# EAGLE board Hodiny4.5 ESP32 (EAGLE 9.1.3)
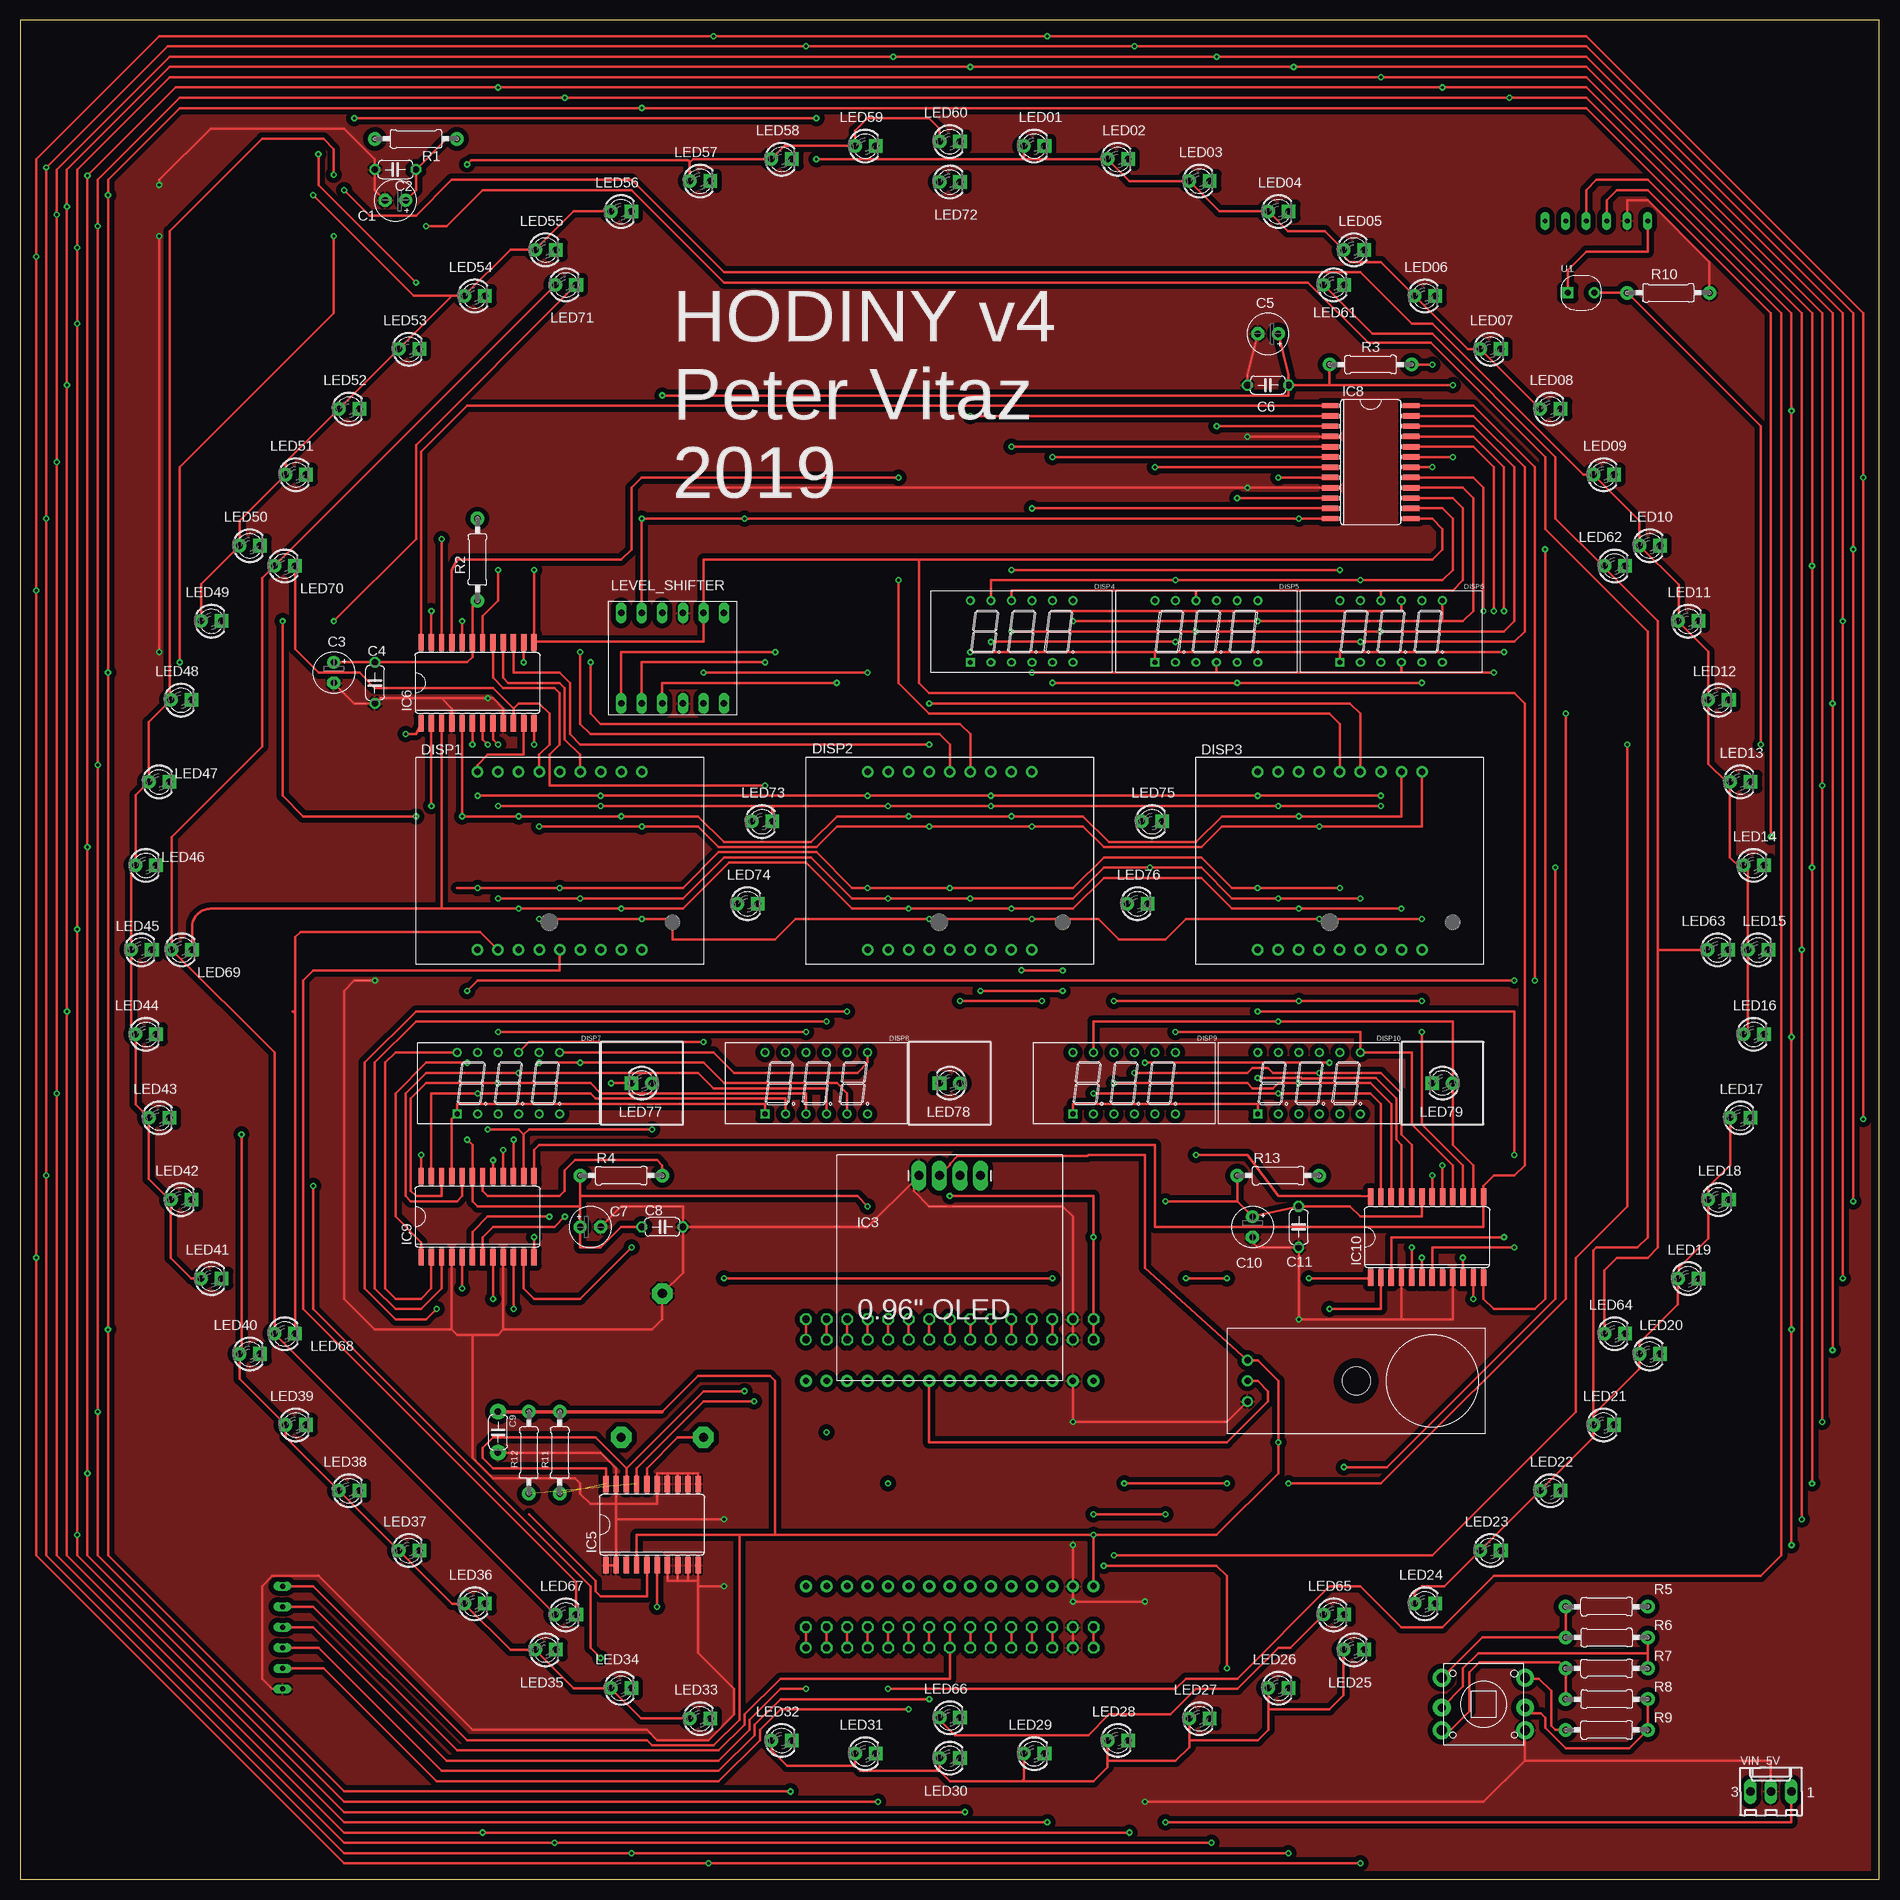
[diagram p1: board, top side]
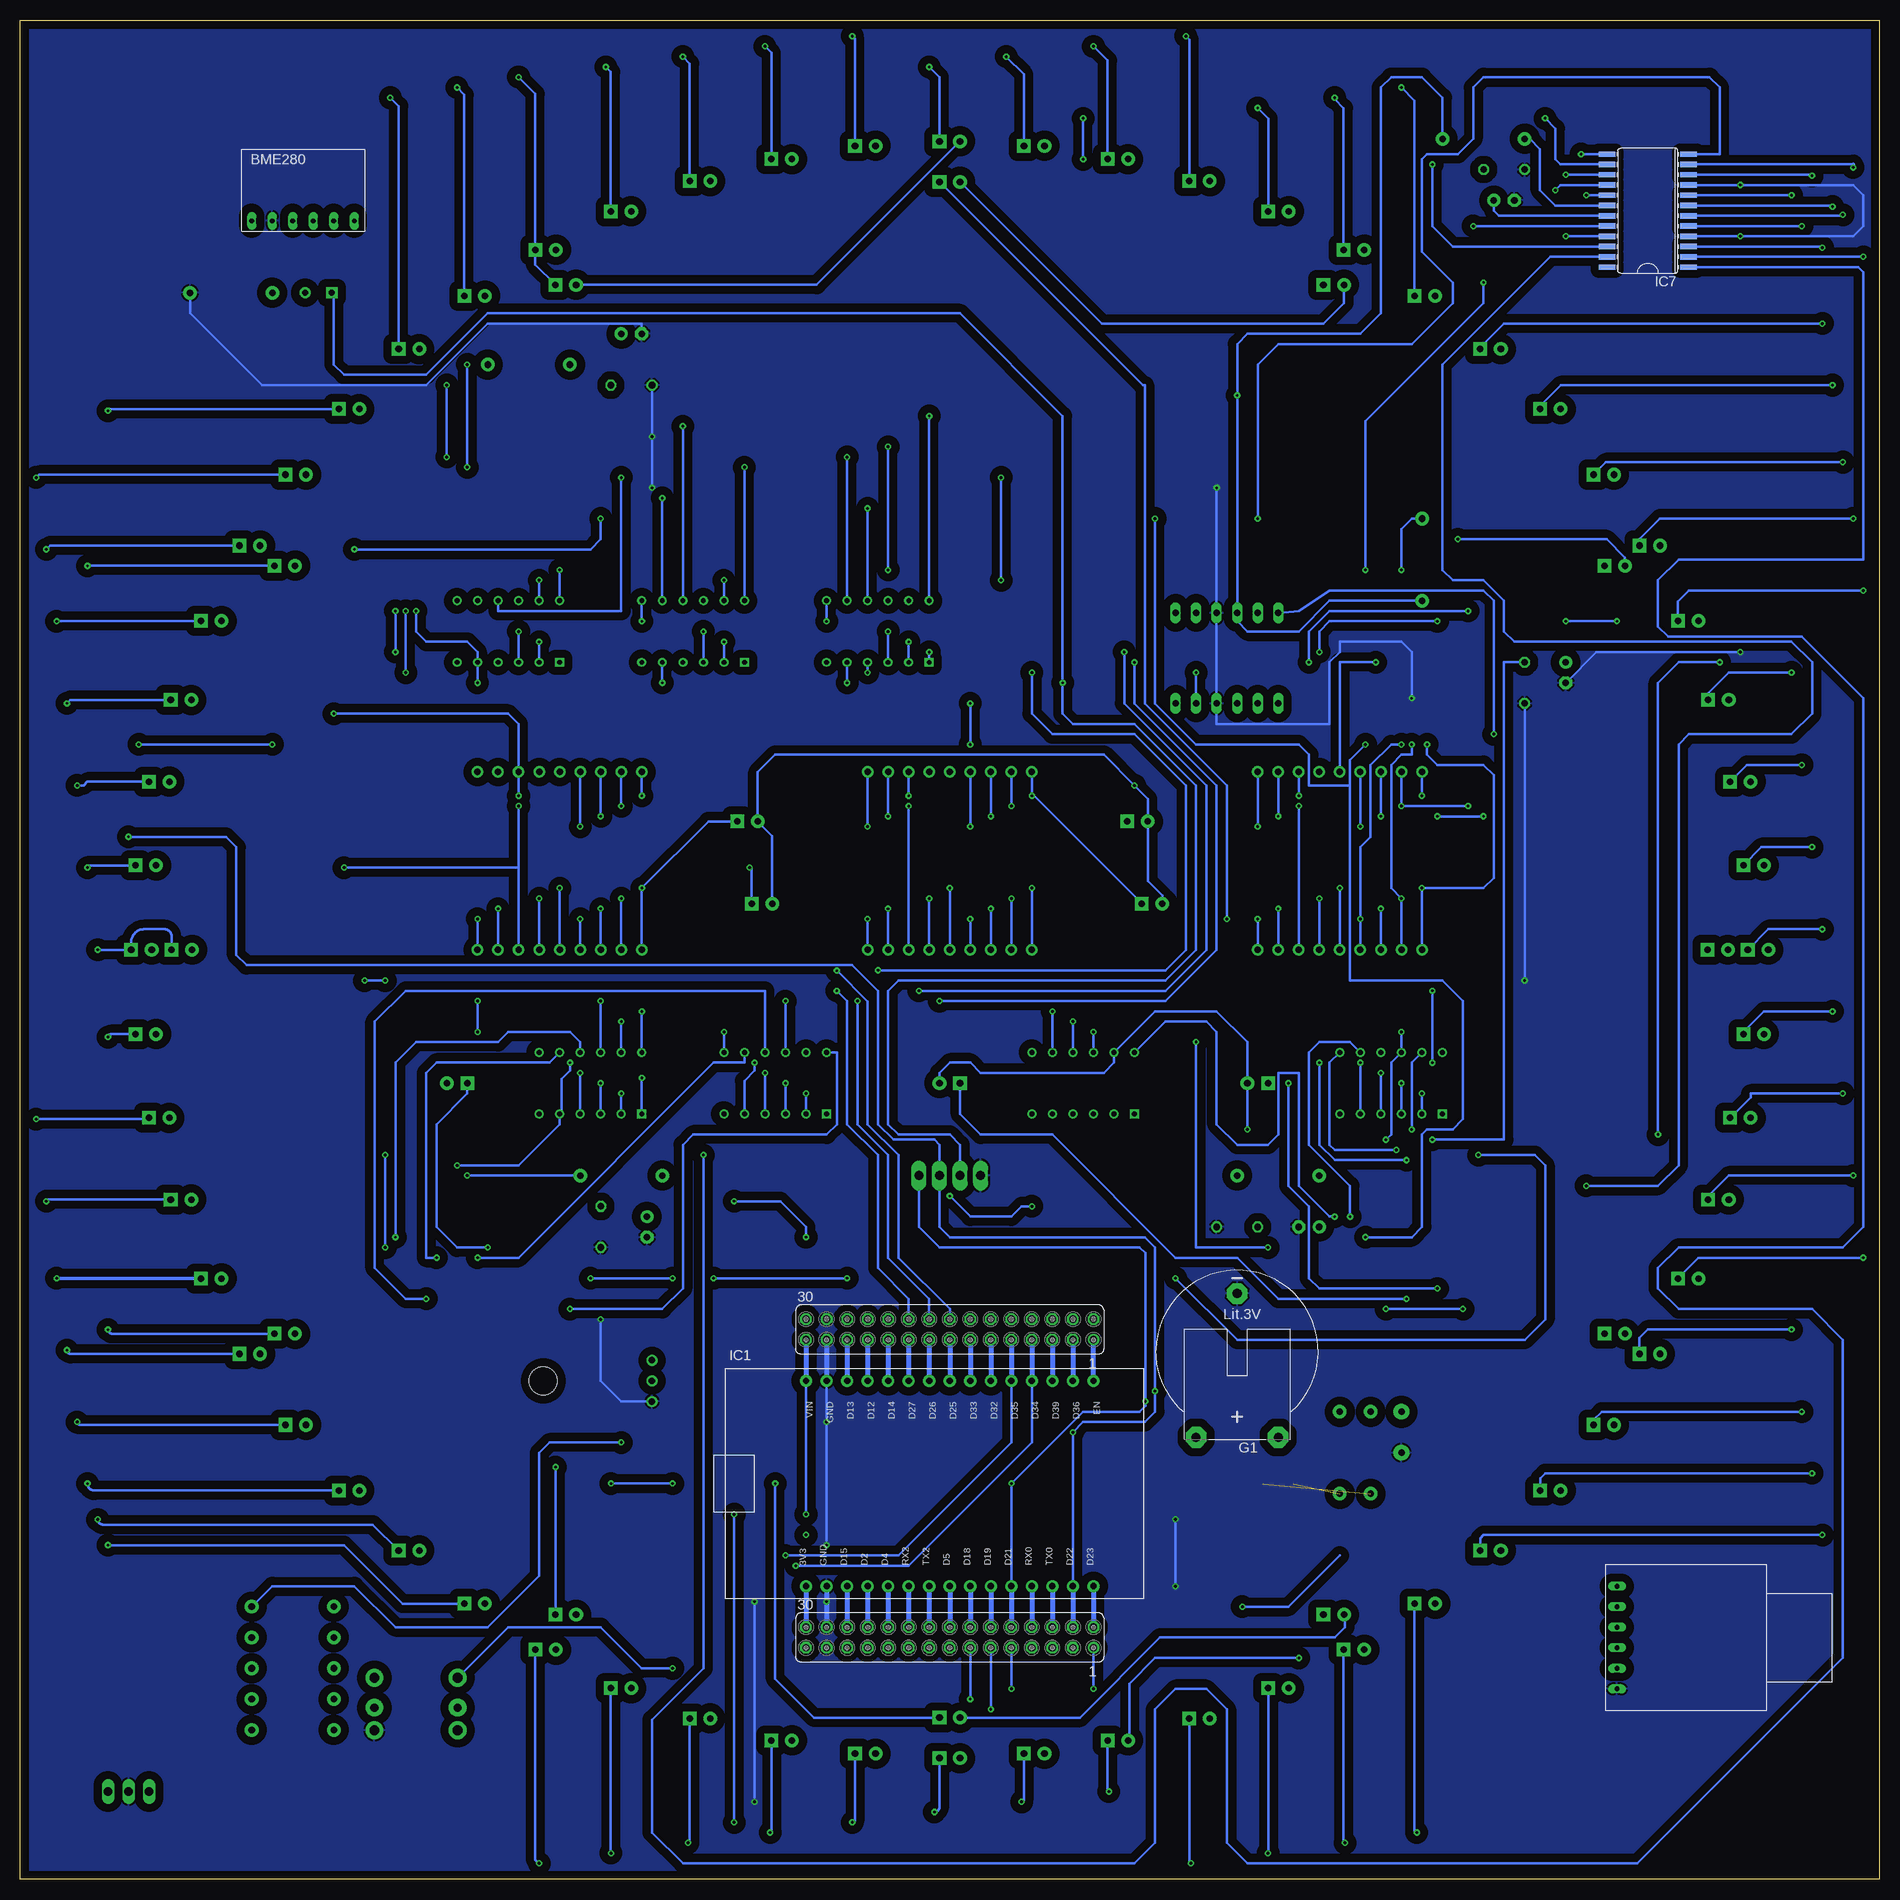
[diagram p2: board, bottom side, seen from below]

Size 230 x 230 mm. Coordinates in mm from the lower left corner, seen from the top.
Outline: 0,0 230,0 230,230 0,230 0,0
Copper layers (1*16): Top 0.035mm / dielectric 1.5mm / Bottom 0.035mm
Design rules "default": minimum track width 6mil, minimum drill 0.35mm, track to track 6mil, track to pad 6mil, pad to pad 6mil, via to via 6mil, smd to smd 6mil, copper to edge 40mil, drill to drill 6mil, minimum pad ring 10mil, minimum via ring 8mil, stop-mask expansion 4mil, vias tented up to drill 0mil, thermal gap 10mil

## Footprints (pad centres in the part's own frame; a part is rotated, then mirrored left to right if it is on the bottom)
E2,5-5 = drill 0.813 pad 1.6: + -1.27,0 | drill 0.813 pad 1.6 octagon: - 1.27,0
C050-024X044 = drill 0.813 octagon: 1 -2.54,0; 2 2.54,0
C050-024X044' = drill 0.813 pad 1.93: 1 -2.54,0; 2 2.54,0
DA08-11EWA = drill 0.8 pad 1.422: 1 -10.16,0; 2 -7.62,0; 3 -5.08,0; 4 -2.54,0; 5 0,0; 6 2.54,0; 7 5.08,0; 8 7.62,0; 9 10.16,0; 10 10.16,22; 11 7.62,22; 12 5.08,22; 13 2.54,22; 14 0,22; 15 -2.54,22; 16 -5.08,22; 17 -7.62,22; 18 -10.16,22
2381AS = drill 0.6 square: 1 0,0 | drill 0.6: 2 2.54,0; 3 5.08,0; 4 7.62,0; 5 10.16,0; 6 12.7,0; 7 12.7,7.62; 8 10.16,7.62; 9 7.62,7.62; 10 5.08,7.62; 11 2.54,7.62; 12 0,7.62
CR2032H = drill 1.118 pad 2.54 octagon: + 5.08,10.795; +@1 -5.08,10.795; - 0,-6.985
ESP32-DEVKITV1A = drill 0.8 pad 1.5: 3V3 0,0; D2 7.62,0; D4 10.16,0; D5 17.78,0; D12 7.62,25.4; D13 5.08,25.4; D14 10.16,25.4; D15 5.08,0; D18 20.32,0; D19 22.86,0; D21 25.4,0; D22 33.02,0; D23 35.56,0; D25 17.78,25.4; D26 15.24,25.4; D27 12.7,25.4; D32 22.86,25.4; D33 20.32,25.4; D34 27.94,25.4; D35 25.4,25.4; D36 33.02,25.4; D39 30.48,25.4; EN 35.56,25.4; GND 2.54,0; GND2 2.54,25.4; RX0 27.94,0; RX2 12.7,0; TX0 30.48,0; TX2 15.24,0; VIN 0,25.4
BME280_MODULE = drill 0.6 long: CSB 10.16,0; GND 2.54,0; SCL 5.08,0; SDA 7.62,0; SDO 12.7,0; VCC 0,0
I2C_OLED_PACKAGE = drill 1.118 pad 1.88 long: 1 0,0; 2 2.54,0; 3 5.08,0; 4 7.62,0
SD_CARD = drill 0.6 long: 3V3 12.7,0; CLK 5.08,0; CS 10.16,0; GND 0,0; MISO 2.54,0; MOSI 7.62,0
SO20L = smd 0.66 x 2.032: 1 -5.715,-5.029; 2 -4.445,-5.029; 3 -3.175,-5.029; 4 -1.905,-5.029; 5 -0.635,-5.029; 6 0.635,-5.029; 7 1.905,-5.029; 8 3.175,-5.029; 9 4.445,-5.029; 10 5.715,-5.029; 11 5.715,5.029; 12 4.445,5.029; 13 3.175,5.029; 14 1.905,5.029; 15 0.635,5.029; 16 -0.635,5.029; 17 -1.905,5.029; 18 -3.175,5.029; 19 -4.445,5.029; 20 -5.715,5.029
SO24L = smd 0.66 x 2.032: 1 -6.985,-5.029; 2 -5.715,-5.029; 3 -4.445,-5.029; 4 -3.175,-5.029; 5 -1.905,-5.029; 6 -0.635,-5.029; 7 0.635,-5.029; 8 1.905,-5.029; 9 3.175,-5.029; 10 4.445,-5.029; 11 5.715,-5.029; 12 6.985,-5.029; 13 6.985,5.029; 14 5.715,5.029; 15 4.445,5.029; 16 3.175,5.029; 17 1.905,5.029; 18 0.635,5.029; 19 -0.635,5.029; 20 -1.905,5.029; 21 -3.175,5.029; 22 -4.445,5.029; 23 -5.715,5.029; 24 -6.985,5.029
LED3MM = drill 0.813 pad 1.676: A -1.27,0 | drill 0.813 pad 1.676 square: K 1.27,0
LVS_4 = drill 0.8 long: 1 0,0; 2 2.54,0; 3 5.08,0; 4 7.62,0; 5 10.16,0; 6 12.7,0; 7 12.7,11.2; 8 10.16,11.2; 9 7.62,11.2; 10 5.08,11.2; 11 2.54,11.2; 12 0,11.2
0207/10 = drill 0.813 pad 1.676: 1 -5.08,0; 2 5.08,0
FE15-2 = drill 0.914: 1 -17.78,1.27 | drill 0.914 octagon: 2 -17.78,-1.27; 3 -15.24,1.27; 4 -15.24,-1.27; 5 -12.7,1.27; 6 -12.7,-1.27; 7 -10.16,1.27; 8 -10.16,-1.27; 9 -7.62,1.27; 10 -7.62,-1.27; 11 -5.08,1.27; 12 -5.08,-1.27; 13 -2.54,1.27; 14 -2.54,-1.27; 15 0,1.27; 16 0,-1.27; 17 2.54,1.27; 18 2.54,-1.27; 19 5.08,1.27; 20 5.08,-1.27; 21 7.62,1.27; 22 7.62,-1.27; 23 10.16,1.27; 24 10.16,-1.27; 25 12.7,1.27; 26 12.7,-1.27; 27 15.24,1.27; 28 15.24,-1.27; 29 17.78,1.27; 30 17.78,-1.27
5-WAY-SWITCH = drill 1.2 pad 2.184: 1 -5.157,3.275; 3 -5.157,-3.225; 4 5.143,-3.225; 6 5.143,3.275 | drill 1 pad 2.184: 2 -5.157,-0.425; 5 5.143,-0.425
SNR2-3.0 = drill 0.762 pad 1.397 square: 1 -1.651,0 | drill 0.762 pad 1.397: 2 1.651,0
BUZZER = drill 0.8: GND 0,-2.54; IO 0,0; VCC 0,2.54 | hole 3.5: 13.46,0
6410-03 = drill 1.016 long: 1 2.54,0; 2 0,0; 3 -2.54,0

## Placement (x,y rotation side)
C1  10u  [E2,5-5]  46.42,207.71 180 top
C2  100n  [C050-024X044]  46.42,211.52 180 top
C3  10u  [E2,5-5]  38.8,149.29 270 top
C4  100n  [C050-024X044]  43.88,148.02 270 top
C5  10u  [E2,5-5]  154.37,191.2 180 top
C6  100n  [C050-024X044]  154.37,184.85 180 top
C7  10u  [E2,5-5]  70.55,80.71 0 top
C8  100n  [C050-024X044]  79.44,80.71 0 top
C9  100n  [C050-024X044']  59.12,55.31 270 top
C10  10u  [E2,5-5]  152.47,80.71 270 top
C11  100n  [C050-024X044]  158.18,80.71 270 top
DISP1  [DA08-11EWA]  66.74,115 0 top
DISP2  [DA08-11EWA]  115,115 0 top
DISP3  [DA08-11EWA]  163.26,115 0 top
DISP4  2381AS  [2381AS]  117.54,150.56 0 top
DISP5  2381AS  [2381AS]  140.4,150.56 0 top
DISP6  2381AS  [2381AS]  163.26,150.56 0 top
DISP7  2381AS  [2381AS]  54.04,94.68 0 top
DISP8  2381AS  [2381AS]  92.14,94.68 0 top
DISP9  2381AS  [2381AS]  130.24,94.68 0 top
DISP10  2381AS  [2381AS]  153.1,94.68 0 top
G1  CR2032H  [CR2032H]  79.44,65.47 180 bottom
IC1  ESP32DEVKITV1NEW  [ESP32-DEVKITV1A]  132.78,36.26 0 bottom
IC2  BME280_MODULE  [BME280_MODULE]  201.36,205.17 0 bottom
IC3  I2C_OLED_NEW  [I2C_OLED_PACKAGE]  111.19,87.06 0 top
IC4  SD_CARD_MODULE  [SD_CARD]  32.45,23.56 90 bottom
IC5  DS3232  [SO20L]  78.17,43.88 0 top
IC6  MAX7219CWG  [SO24L]  56.58,148.02 0 top
IC7  MAX7219CWG  [SO24L]  28.64,206.44 90 bottom
IC8  MAX7219CWG  [SO24L]  167.07,175.32 270 top
IC9  MAX7219CWG  [SO24L]  56.58,81.98 0 top
IC10  MAX7219CWG  [SO24L]  174.06,79.44 0 top
LED01  [LED3MM]  125.45,214.45 0 top
LED02  [LED3MM]  135.79,212.81 0 top
LED03  [LED3MM]  145.9,210.11 0 top
LED04  [LED3MM]  155.67,206.35 0 top
LED05  [LED3MM]  165,201.6 0 top
LED06  [LED3MM]  173.78,195.9 0 top
LED07  [LED3MM]  181.91,189.31 0 top
LED08  [LED3MM]  189.31,181.91 0 top
LED09  [LED3MM]  195.9,173.78 0 top
LED10  [LED3MM]  201.6,165 0 top
LED11  [LED3MM]  206.35,155.67 0 top
LED12  [LED3MM]  210.11,145.9 0 top
LED13  [LED3MM]  212.81,135.79 0 top
LED14  [LED3MM]  214.45,125.45 0 top
LED15  [LED3MM]  215,115 0 top
LED16  [LED3MM]  214.45,104.55 0 top
LED17  [LED3MM]  212.81,94.21 0 top
LED18  [LED3MM]  210.11,84.1 0 top
LED19  [LED3MM]  206.35,74.33 0 top
LED20  [LED3MM]  201.6,65 0 top
LED21  [LED3MM]  195.9,56.22 0 top
LED22  [LED3MM]  189.31,48.09 0 top
LED23  [LED3MM]  181.91,40.69 0 top
LED24  [LED3MM]  173.78,34.1 0 top
LED25  [LED3MM]  165,28.4 0 top
LED26  [LED3MM]  155.67,23.65 0 top
LED27  [LED3MM]  145.9,19.89 0 top
LED28  [LED3MM]  135.79,17.19 0 top
LED29  [LED3MM]  125.45,15.55 0 top
LED30  [LED3MM]  115,15 0 top
LED31  [LED3MM]  104.55,15.55 0 top
LED32  [LED3MM]  94.21,17.19 0 top
LED33  [LED3MM]  84.1,19.89 0 top
LED34  [LED3MM]  74.33,23.65 0 top
LED35  [LED3MM]  65,28.4 0 top
LED36  [LED3MM]  56.22,34.1 0 top
LED37  [LED3MM]  48.09,40.69 0 top
LED38  [LED3MM]  40.69,48.09 0 top
LED39  [LED3MM]  34.1,56.22 0 top
LED40  [LED3MM]  28.4,65 0 top
LED41  [LED3MM]  23.65,74.33 0 top
LED42  [LED3MM]  19.89,84.1 0 top
LED43  [LED3MM]  17.19,94.21 0 top
LED44  [LED3MM]  15.55,104.55 0 top
LED45  [LED3MM]  15,115 0 top
LED46  [LED3MM]  15.55,125.45 0 top
LED47  [LED3MM]  17.19,135.79 0 top
LED48  [LED3MM]  19.89,145.9 0 top
LED49  [LED3MM]  23.65,155.67 0 top
LED50  [LED3MM]  28.4,165 0 top
LED51  [LED3MM]  34.1,173.78 0 top
LED52  [LED3MM]  40.69,181.91 0 top
LED53  [LED3MM]  48.09,189.31 0 top
LED54  [LED3MM]  56.22,195.9 0 top
LED55  [LED3MM]  65,201.6 0 top
LED56  [LED3MM]  74.33,206.35 0 top
LED57  [LED3MM]  84.1,210.11 0 top
LED58  [LED3MM]  94.21,212.81 0 top
LED59  [LED3MM]  104.55,214.45 0 top
LED60  [LED3MM]  115,215 0 top
LED61  [LED3MM]  162.5,197.27 0 top
LED62  [LED3MM]  197.27,162.5 0 top
LED63  [LED3MM]  210,115 0 top
LED64  [LED3MM]  197.27,67.5 0 top
LED65  [LED3MM]  162.5,32.73 0 top
LED66  [LED3MM]  115,20 0 top
LED67  [LED3MM]  67.5,32.73 0 top
LED68  [LED3MM]  32.73,67.5 0 top
LED69  [LED3MM]  20,115 0 top
LED70  [LED3MM]  32.73,162.5 0 top
LED71  [LED3MM]  67.5,197.27 0 top
LED72  [LED3MM]  115,210 0 top
LED73  [LED3MM]  91.77,130.88 0 top
LED74  [LED3MM]  89.97,120.72 0 top
LED75  [LED3MM]  140.03,130.88 0 top
LED76  [LED3MM]  138.24,120.72 0 top
LED77  [LED3MM]  76.9,98.49 180 top
LED78  [LED3MM]  115,98.49 180 top
LED79  [LED3MM]  175.96,98.49 180 top
LEVEL_SHIFTER  LEVEL_SHIFTER_4  [LVS_4]  74.36,145.48 0 top
R1  27k  [0207/10]  48.96,215.33 180 top
R2  27k  [0207/10]  56.58,163.26 90 top
R3  27k  [0207/10]  167.07,187.39 0 top
R4  27k  [0207/10]  74.36,87.06 0 top
R5  2k  [0207/10]  196.28,33.72 0 top
R6  330  [0207/10]  196.28,29.91 180 top
R7  620  [0207/10]  196.28,26.1 0 top
R8  1k  [0207/10]  196.28,22.29 180 top
R9  3k3  [0207/10]  196.28,18.48 0 top
R10  10k  [0207/10]  203.9,196.28 180 top
R11  1k2  [0207/10]  66.74,52.77 90 top
R12  1k2  [0207/10]  62.93,52.77 90 top
R13  27k  [0207/10]  155.64,87.06 0 top
SV1  [FE15-2]  115,29.91 180 bottom
SV2  [FE15-2]  115,68.01 180 bottom
SWITCH  5-WAY-SWITCH  [5-WAY-SWITCH]  181.04,21.66 0 top
U1  VT93N2  [SNR2-3.0]  193.11,196.28 0 top
U$2  BUZZER_FC-07  [BUZZER]  151.83,61.66 0 top
VIN_5V  22-27-2031-03  [6410-03]  216.6,10.86 0 top

## Tracks (layer width: path | path; a pad name or v marks a point on that pad's centre or on a via)
3V3  (via drill 0.35)
  Top 0.305: 191.2,196.53 U1.1 191.45,199.07 193.74,201.36 201.36,201.36 IC2.VCC | LEVEL_SHIFTER.3 79.44,148.02 v101.03,148.02 | IC4.3V3 36.26,36.26 55.31,17.21 77.53,17.21 78.17,16.58 85.79,16.58 88.97,19.75 88.97,42.61 | v132.78,42.61 148.02,42.61 155.64,50.23 v155.64,54.04 155.64,61.66 153.1,64.2 U$2.VCC 139.13,75.63 139.13,89.6 132.15,89.6 132.02,89.48 115.99,89.48 115.03,88.52 115.03,88.36 IC3.2 | v132.78,42.61 IC1.3V3 | v132.78,42.61 93.41,42.61 | 93.41,42.61 88.97,42.61 | 88.97,42.61 76.27,42.61 IC5.4 | 79.44,57.85 83.89,62.3 92.78,62.3 93.41,61.66 93.41,42.61 | SV1.30 SV1.29
  Top 0.406: C9.1 R12.2 R11.2 79.44,57.85
  Bottom 0.305: U1.1 191.2,196.03 191.2,187.39 189.93,186.12 179.77,186.12 172.15,193.74 113.73,193.74 101.03,181.04 v101.03,148.02 101.03,144.21 99.76,142.94 92.14,142.94 84.52,135.32 84.52,115 88.33,111.19 121.35,111.19 122.62,109.92 122.62,93.41 121.35,92.14 115,92.14 113.73,90.87 IC3.2 | R5.2 198.82,36.26 188.66,36.26 183.58,31.18 172.15,31.18 165.8,37.53 165.8,52.77 164.53,54.04 v155.64,54.04
  Bottom 0.61: IC1.3V3 SV1.30
!INT
  Top 0.305: IC5.5 77.53,34.99 71.82,34.99 71.19,35.62 71.19,36.89 62.93,45.15
!RST  (via drill 0.35)
  Top 0.305: IC5.6 v78.81,33.72
  Bottom 0.305: v78.81,33.72 73.09,33.72 66.74,40.07
+5V  (via drill 0.35)
  Top 0.305: C6.1 156.91,186.12 C5.+ | IC8.19 v177.23,175.96 | v177.23,184.85 161.99,184.85 | 161.99,184.85 C6.1 | R3.1 161.99,184.85 | R1.1 52.77,215.33 C2.1 48.96,208.98 C1.+ | C3.+ C4.1 55.31,150.56 55.95,151.19 IC6.19 55.95,157.55 R2.1 | C6.1 156.91,183.58 v79.44,183.58 | 69.28,83.25 56.58,83.25 55.95,83.89 IC9.19 55.95,90.87 v55.31,91.5 | 69.28,83.25 69.28,84.52 | 69.28,84.52 R4.1 | 69.28,83.25 C7.+ 69.28,78.17 71.82,78.17 74.36,80.71 C8.1 | VIN_5V.1 219.14,7.05 v141.67,7.05 | v132.78,45.15 v141.67,45.15 | R13.1 150.56,83.89 | 150.56,83.89 C10.+ C11.1 164.53,83.25 165.8,81.98 173.42,81.98 IC10.19 | 150.56,83.89 v141.67,83.89 | 69.28,84.52 103.57,84.52 v104.84,83.25 | v115,84.52 132.78,84.52 v132.78,79.44 SV2.30 SV2.29
  Bottom 0.305: v177.23,175.96 v177.23,184.85 | IC7.19 47.06,205.81 47.69,206.44 C1.+ | R2.1 68.01,158.18 71.82,154.37 78.17,154.37 79.44,155.64 LEVEL_SHIFTER.10 v79.44,183.58 79.44,189.93 78.17,191.2 64.2,191.2 61.66,193.74 61.66,221.68 60.39,222.95 56.58,222.95 54.04,220.41 R1.1 | v55.31,91.5 46.42,91.5 46.42,150.56 C4.1 | IC1.VIN v132.78,45.15 | v132.78,79.44 132.78,80.71 135.95,83.89 v141.67,83.89 | v104.84,83.25 106.11,83.25 107.38,81.98 112.46,81.98 v115,84.52 | v141.67,45.15 v141.67,7.05
  Bottom 0.61: SV2.29 IC1.VIN
A0  (via drill 0.35)
  Top 0.305: U1.2 R10.2 215.33,179.77 v215.33,140.4 | SV2.10 SV2.9 | v198.82,140.4 198.82,83.25 192.47,76.9 192.47,57.85 174.69,40.07 155.64,40.07 v135.32,40.07
  Bottom 0.305: v215.33,140.4 v198.82,140.4 | IC1.D35 107.38,54.04 121.35,40.07 134.05,40.07 v135.32,40.07
  Bottom 0.61: SV2.9 IC1.D35
BUZZ
  Top 0.305: U$2.IO 153.1,61.66 154.37,60.39 154.37,59.12 149.29,54.04 112.46,54.04 IC1.D33 | SV2.13 SV2.14
  Bottom 0.61: SV2.13 IC1.D33
CLK_H  (via drill 0.35)
  Top 0.305: IC8.13 174.69,168.34 175.96,167.07 175.96,164.53 174.69,163.26 111.19,163.26 | 111.19,163.26 84.52,163.26 LEVEL_SHIFTER.8 84.52,153.1 63.62,153.1 IC6.13 v63.56,161.99 | 111.19,163.26 111.19,148.02 112.46,146.75 184.85,146.75 186.12,145.48 186.12,88.33 184.85,87.06 182.31,87.06 181.04,85.79 IC10.13 181.04,80.71 140.4,80.71 140.4,90.87 64.2,90.87 63.56,90.23 IC9.13 | v36.89,213.43 36.89,209.62 v48.96,197.55
  Bottom 0.305: IC7.13 v36.89,213.43 | v48.96,197.55 48.96,195.01 63.56,180.41 v63.56,161.99
CLK_L  (via drill 0.35)
  Top 0.305: v104.84,149.29 v84.52,149.29 | v123.89,112.46 128.97,112.46 v128.97,112.41 | SV2.16 SV2.15
  Bottom 0.305: LEVEL_SHIFTER.5 v84.52,149.29 | v104.84,149.29 104.84,144.21 102.3,141.67 92.14,141.67 85.79,135.32 85.79,115 88.33,112.46 v123.89,112.46 | v128.97,112.41 125.16,108.6 125.16,93.41 121.35,89.6 121.35,76.9 115,70.55 SV2.16
  Bottom 0.61: SV2.15 IC1.D25
DG0  (via drill 0.35)
  Top 0.305: v59.12,132.78 v71.82,132.78 93.41,132.78 | 93.41,132.78 v107.38,132.78 v120.08,132.78 v155.64,132.78 v168.34,132.78 | LED73.K 93.03,132.41 arc-90 93.41,132.78 | IC6.2 v50.86,132.78 | v189.93,125.16 189.93,71.82 169.1,50.99 v163.77,50.99
  Bottom 0.305: DISP1.17 v59.12,132.78 v50.86,132.78 | v107.38,132.78 DISP2.17 | v155.64,132.78 DISP3.17 | DISP1.7 v71.82,132.78 | DISP2.7 v120.08,132.78 | DISP3.7 168.34,125.16 | 168.34,125.16 v168.34,132.78 | LED65.K v163.77,50.99 | 168.34,125.16 v189.93,125.16
DG1  (via drill 0.35)
  Top 0.305: v56.58,134.05 v71.82,134.05 v104.84,134.05 v120.08,134.05 v153.1,134.05 v168.34,134.05 | DISP1.18 56.58,137.86 57.85,139.13 62.3,139.13 62.3,141.67 62.3,142.31 IC6.11 | v191.2,144.21 191.2,71.82 168.34,48.96 v156.91,48.96 | v149.29,48.96 v136.59,48.96
  Bottom 0.305: DISP1.18 v56.58,134.05 | DISP2.18 v104.84,134.05 104.58,134.05 LED74.K | v168.34,134.05 DISP3.12 168.34,142.94 169.61,144.21 v191.2,144.21 | DISP3.18 v153.1,134.05 | DISP2.12 v120.08,134.05 | DISP1.12 v71.82,134.05 | LED66.K 131.76,20 136.59,24.83 v136.59,48.96 | v156.91,48.96 v149.29,48.96
DG2  (via drill 0.35)
  Top 0.305: v163.26,122.62 v153.1,122.62 149.93,122.62 146.12,126.43 134.05,126.43 130.24,122.62 v115,122.62 v104.84,122.62 102.94,122.62 98.49,127.06 86.42,127.06 81.98,122.62 v66.74,122.62 v56.58,122.62 54.04,122.62 | IC6.6 v55.95,140.4 | DISP1.5 66.74,112.46 36.26,112.46 34.99,111.19 34.99,70.55 68.77,36.77 LED67.K
  Bottom 0.305: DISP1.1 v56.58,122.62 48.96,122.62 47.69,123.89 47.69,136.59 48.96,137.86 54.67,137.86 55.95,139.13 v55.95,140.4 | v66.74,122.62 DISP1.5 | DISP2.1 v104.84,122.62 | DISP2.5 v115,122.62 | DISP3.1 v153.1,122.62 144.84,130.88 LED75.K | DISP3.5 v163.26,122.62
DG3  (via drill 0.35)
  Top 0.305: v59.12,121.35 v69.28,121.35 81.98,121.35 87.06,126.43 97.86,126.43 102.94,121.35 v107.38,121.35 v117.54,121.35 130.24,121.35 134.05,125.16 v139.76,125.16 146.12,125.16 149.93,121.35 v155.64,121.35 v165.8,121.35 | LED68.K 34,107.1 | 34,107.1 arc90 33.72,107.38 | IC6.7 57.22,141.03 v57.85,140.4 | DISP1.2 56.9,117.22 34.67,117.22 34,116.55 34,107.1
  Bottom 0.305: DISP1.2 v59.12,121.35 60.39,122.62 60.39,137.86 59.12,139.13 57.85,139.13 v57.85,140.4 | v69.28,121.35 DISP1.6 | DISP2.2 v107.38,121.35 | DISP2.6 v117.54,121.35 | DISP3.2 v155.64,121.35 | DISP3.6 v165.8,121.35 | LED76.K 139.5,124.9 v139.76,125.16
DG4  (via drill 0.35)
  Top 0.305: v170.88,120.08 v158.18,120.08 149.93,120.08 146.12,123.89 134.05,123.89 130.24,120.08 v122.62,120.08 v109.92,120.08 102.94,120.08 97.22,125.8 87.69,125.8 81.98,120.08 v74.36,120.08 v61.66,120.08 52.13,120.08 | 21.02,114.75 arc-90 LED69.K 21.27,117.79 arc-90 23.56,120.08 52.13,120.08 | IC6.3 52.13,120.08
  Bottom 0.305: DISP1.3 v61.66,120.08 | DISP1.8 v74.36,120.08 | v122.62,120.08 DISP2.8 | DISP2.3 v109.92,120.08 | DISP3.3 v158.18,120.08 | DISP3.8 v170.88,120.08
DG5  (via drill 0.35)
  Top 0.305: v64.2,130.24 v76.9,130.24 83.89,130.24 86.42,127.7 98.49,127.7 101.03,130.24 v112.46,130.24 v125.16,130.24 131.51,130.24 134.05,127.7 146.12,127.7 148.66,130.24 v160.72,130.24 173.42,130.24 DISP3.10 | IC6.10 61.02,144.84 | DISP1.15 64.2,139.13 65.47,140.4 65.47,144.21 64.2,145.48 61.66,145.48 61.02,144.84 | 61.02,144.84 58.48,147.38 43.88,147.38 41.97,149.29 36.89,149.29 34,152.19 LED70.K
  Bottom 0.305: DISP1.15 v64.2,130.24 | v112.46,130.24 DISP2.15 | DISP1.10 v76.9,130.24 | DISP2.10 v125.16,130.24 | DISP3.15 v160.72,130.24
DG6  (via drill 0.35)
  Top 0.305: IC6.5 v54.67,131.51 v61.66,131.51 v74.36,131.51 83.89,131.51 87.06,128.34 97.86,128.34 101.03,131.51 v109.92,131.51 v122.62,131.51 131.51,131.51 134.69,128.34 145.48,128.34 148.66,131.51 v158.18,131.51 170.88,131.51 DISP3.11 | v32.45,155.64 32.45,134.05 34.99,131.51 v48.96,131.51 | v38.8,155.64 48.96,165.8 48.96,177.46 LED71.K
  Bottom 0.305: DISP1.16 v61.66,131.51 | v109.92,131.51 DISP2.16 | DISP1.11 v74.36,131.51 | DISP2.11 v122.62,131.51 | DISP3.16 v158.18,131.51 | v54.67,131.51 v48.96,131.51 | v32.45,155.64 v38.8,155.64
DG7  (via drill 0.35)
  Top 0.305: v64.2,118.81 v76.9,118.81 v80.71,118.81 80.71,116.27 93.41,116.27 95.95,118.81 v112.46,118.81 v125.16,118.81 133.41,118.81 135.95,116.27 141.67,116.27 144.21,118.81 v160.72,118.81 v173.42,118.81 | v59.12,140.4 58.48,141.03 IC6.8
  Bottom 0.305: DISP1.4 v64.2,118.81 64.2,127.7 62.93,128.97 62.93,137.86 60.39,140.4 v59.12,140.4 | DISP1.9 v76.9,118.81 | DISP2.9 v125.16,118.81 | DISP3.4 v160.72,118.81 | v173.42,118.81 DISP3.9 | DISP2.4 v112.46,118.81 | v80.71,118.81 80.71,135.32 90.87,145.48 90.87,184.85 91.12,184.85 LED72.K
DIG0  (via drill 0.35)
  Top 0.305: v228.03,94.05 v228.03,173.42 228.03,193.74 193.74,228.03 v127.06,228.03 v85.79,228.03 17.21,228.03 1.97,212.79 v1.97,200.72 v1.97,159.45 v1.97,76.9 1.97,40.07 40.07,1.97 v85.16,1.97 v165.8,1.97
  Bottom 0.305: LED41.K 24.92,74.36 22.38,76.9 v1.97,76.9 | v228.03,94.05 214.25,94.05 arc-90 LED17.K | LED57.K 85.37,227.61 v85.79,228.03 | LED49.K 24.92,158.09 23.56,159.45 v1.97,159.45 | IC7.2 v1.97,200.72 | LED09.K 227.67,173.78 v228.03,173.42 | LED25.K 166.27,2.44 v165.8,1.97 | LED33.K 85.37,2.19 v85.16,1.97 | v127.06,228.03 126.72,227.69 LED01.K
DIG1  (via drill 0.35)
  Top 0.305: v156.91,3.24 v75.63,3.24 40.07,3.24 3.24,40.07 v3.24,87.06 v3.24,168.34 v3.24,211.77 18.23,226.76 v97.22,226.76 v137.86,226.76 193.74,226.76 226.76,193.74 v226.76,164.53 v226.76,83.89
  Bottom 0.305: LED02.K 137.06,225.96 v137.86,226.76 | LED58.K 95.48,225.02 v97.22,226.76 | LED50.K 29.67,165.8 27.13,168.34 v3.24,168.34 | LED42.K 21.16,84.52 18.62,87.06 v3.24,87.06 | LED34.K 75.6,3.27 arc90 v75.63,3.24 | LED26.K 156.94,3.27 arc-90 v156.91,3.24 | LED10.K 226.29,165 v226.76,164.53 | LED18.K 226.55,84.1 arc-90 v226.76,83.89 | IC7.11 3.24,212.16
  Bottom 0.406: 3.24,212.16 v3.24,211.77
DIG2  (via drill 0.35)
  Top 0.305: v147.38,4.51 v66.1,4.51 40.07,4.51 4.51,40.07 v4.51,97.22 v4.51,175.32 v4.51,205.93 4.51,211.52 18.48,225.49 v108.02,225.49 v148.02,225.49 193.74,225.49 225.49,193.74 v225.49,155.64 v225.49,74.36
  Bottom 0.305: LED59.K 105.82,223.3 v108.02,225.49 | v4.51,175.32 33.83,175.32 LED51.K | v4.51,97.22 15.92,97.22 15.92,96.75 LED43.K | LED35.K 66.27,4.67 arc-90 v66.1,4.51 | LED27.K 147.17,4.72 arc90 v147.38,4.51 | LED11.K 225.46,155.67 arc-90 v225.49,155.64 | IC7.6 4.51,205.81 | v148.02,225.49 147.17,224.64 LED03.K
  Bottom 0.406: LED19.K 225.46,74.33 arc90 v225.49,74.36 | 4.51,205.81 v4.51,205.93
DIG3  (via drill 0.35)
  Top 0.305: v137.22,5.78 v57.22,5.78 40.07,5.78 5.78,40.07 v5.78,107.38 v5.78,184.85 v5.78,206.95 5.78,211.52 18.48,224.22 v117.54,224.22 v157.55,224.22 193.74,224.22 224.22,193.74 v224.22,145.48 v224.22,65.47
  Bottom 0.305: LED04.K 156.94,223.62 v157.55,224.22 | LED60.K 116.27,222.95 v117.54,224.22 | LED52.K 41.96,182.31 39.42,184.85 v5.78,184.85 | LED44.K 16.82,104.84 14.28,107.38 v5.78,107.38 | LED36.K 57.49,6.06 arc-90 v57.22,5.78 | LED28.K 137.06,5.94 arc90 v137.22,5.78 | LED12.K 223.8,145.9 v224.22,145.48 | LED20.K 223.75,65 arc90 v224.22,65.47 | IC7.7 5.78,207.07
  Bottom 0.406: 5.78,207.07 v5.78,206.95
DIG4  (via drill 0.35)
  Top 0.305: v222.95,56.58 v222.95,135.32 222.95,193.74 193.74,222.95 v168.34,222.95 18.48,222.95 7.05,211.52 v7.05,201.87 v7.05,192.47 v7.05,117.54 v7.05,42.61 7.05,40.07 40.07,7.05 v127.06,7.05
  Bottom 0.305: v7.05,192.47 46.42,192.47 49.36,189.53 LED53.K | v7.05,117.54 13.73,117.54 LED45.K | LED29.K 126.72,7.39 arc90 v127.06,7.05 | LED13.K 221.68,135.79 222.15,135.32 v222.95,135.32 | LED21.K 222.59,56.22 arc90 v222.95,56.58 | IC7.3 7.05,202 | v7.05,42.61 48.96,42.61 49.36,42.21 LED37.K | v168.34,222.95 166.27,220.88 LED05.K 166.27,199.77 LED61.K
  Bottom 0.406: 7.05,202 v7.05,201.87
DIG5  (via drill 0.35)
  Top 0.305: v221.68,48.96 v221.68,125.16 v221.68,162.5 221.68,193.74 193.74,221.68 v175.96,221.68 v59.12,221.68 19.24,221.68 v8.32,210.76 v8.32,127.7 v8.32,50.23 8.32,40.07 40.07,8.32 v116.91,8.32
  Bottom 0.305: LED54.K 57.49,220.05 v59.12,221.68 | v8.32,127.7 14.57,127.7 LED46.K | LED30.K 116.27,8.95 arc90 v116.91,8.32 | LED14.K 221.39,125.45 arc-90 v221.68,125.16 | LED22.K 220.81,48.09 arc90 v221.68,48.96 | IC7.10 8.32,210.88 | LED62.K v221.68,162.5 | LED38.K 41.96,49.61 41.34,50.23 v8.32,50.23 | v175.96,221.68 175.05,220.77 LED06.K
  Bottom 0.406: 8.32,210.88 v8.32,210.76
DIG6  (via drill 0.35)
  Top 0.305: v220.41,44.52 v220.41,115 220.41,193.74 193.74,220.41 v184.22,220.41 v67.38,220.41 19.75,220.41 9.59,210.25 v9.59,204.53 v9.59,137.86 v9.59,57.85 9.59,40.07 40.07,9.59 v106.11,9.59
  Bottom 0.305: LED55.K 66.27,219.14 67.38,220.25 v67.38,220.41 | v9.59,137.86 16.39,137.86 LED47.K | v9.59,57.85 34.36,57.85 35.37,56.84 LED39.K | LED31.K 105.82,9.88 arc90 v106.11,9.59 | LED07.K 183.18,219.38 v184.22,220.41 | v220.41,115 LED15.K 216.27,115.97 arc90 214.69,117.54 212.16,117.54 arc90 211.27,116.66 LED63.K | v220.41,44.52 arc-90 219.78,43.88 186.37,43.88 LED23.K | IC7.5 v9.59,204.53
DIG7  (via drill 0.35)
  Top 0.305: v219.14,41.34 v219.14,68.01 v219.14,104.2 v219.14,181.68 219.14,193.74 193.74,219.14 v76.9,219.14 19.75,219.14 10.86,210.25 v10.86,208.34 v10.86,149.29 v10.86,68.01 10.86,40.07 40.07,10.86 v95.31,10.86
  Bottom 0.305: LED56.K 75.6,217.84 v76.9,219.14 | LED48.K 21.16,146.75 18.62,149.29 v10.86,149.29 | 29.67,65.47 LED40.K 29.67,66.98 28.64,68.01 v10.86,68.01 | v219.14,181.68 arc90 218.91,181.91 LED08.K | LED16.K 218.8,104.55 arc-90 v219.14,104.2 | LED64.K 218.63,67.5 arc90 v219.14,68.01 | LED32.K 95.48,11.03 arc-90 v95.31,10.86 | v219.14,41.34 189.93,41.34 182.69,34.1 LED24.K | IC7.8 v10.86,208.34
  Bottom 0.406: v10.86,208.34 10.86,208.22
DIGA0  (via drill 0.35)
  Top 0.305: v117.54,181.04 IC8.2
  Bottom 0.305: DISP4.12 v117.54,181.04
DIGA1  (via drill 0.35)
  Top 0.305: IC8.11 v125.16,169.61
  Bottom 0.305: DISP4.9 v125.16,169.61
DIGA2  (via drill 0.35)
  Top 0.305: IC8.6 v127.7,175.96
  Bottom 0.305: DISP4.8 v127.7,175.96
DIGA3  (via drill 0.35)
  Top 0.305: IC8.7 v140.4,174.69
  Bottom 0.305: DISP5.12 v140.4,174.69
DIGA4  (via drill 0.35)
  Top 0.305: IC8.3 v148.02,179.77
  Bottom 0.305: DISP5.9 v148.02,179.77
DIGA5  (via drill 0.35)
  Top 0.305: v150.56,170.88 IC8.10
  Bottom 0.305: DISP5.8 v150.56,170.88
DIGA6  (via drill 0.35)
  Top 0.305: IC8.5 v122.62,177.23 | v163.26,161.99 v122.62,161.99
  Bottom 0.305: DISP6.12 v163.26,161.99 | v122.62,161.99 v122.62,177.23
DIGA7  (via drill 0.35)
  Top 0.305: DISP6.9 170.88,156.91 127.7,156.91 | IC8.8 v155.64,173.42
  Bottom 0.305: v155.64,173.42 155.64,156.91 170.88,156.91 DISP6.9
DIGB0  (via drill 0.35)
  Top 0.305: IC10.2 168.34,70.55 v161.99,70.55
  Bottom 0.305: v161.99,70.55 150.56,70.55 148.02,73.09 148.02,90.87 146.75,92.14 130.24,92.14 128.97,93.41 128.97,102.3 DISP9.12
DIGB1  (via drill 0.35)
  Top 0.305: v179.77,71.82 IC10.11
  Bottom 0.305: DISP9.9 137.86,109.92 182.31,109.92 186.12,106.11 186.12,75.63 182.31,71.82 v179.77,71.82
DIGB2  (via drill 0.35)
  Top 0.305: v173.42,76.9 IC10.6
  Bottom 0.305: DISP9.8 140.4,101.03 144.21,101.03 168.34,76.9 v173.42,76.9
DIGB3  (via drill 0.35)
  Top 0.305: v153.1,107.38 184.85,107.38 v184.85,89.6 | IC10.7 174.69,78.17 v184.85,78.17
  Bottom 0.305: v184.85,78.17 v184.85,89.6 | v153.1,107.38 DISP10.12
DIGB4  (via drill 0.35)
  Top 0.305: v183.58,79.44 169.61,79.44 IC10.3
  Bottom 0.305: DISP10.9 160.72,103.57 161.99,104.84 169.61,104.84 170.88,103.57 181.04,103.57 183.58,101.03 v183.58,79.44
DIGB5  (via drill 0.35)
  Top 0.305: IC10.10 v178.5,76.9
  Bottom 0.305: v178.5,76.9 179.77,76.9 179.77,99.76 178.5,101.03 164.53,101.03 DISP10.8
DIGB6  (via drill 0.35)
  Top 0.305: IC10.5 v172.15,78.17
  Bottom 0.305: v172.15,78.17 175.96,78.17 178.5,80.71 178.5,93.41 174.69,97.22 LED79.K
DIGC0
  Top 0.305: IC9.2 50.86,73.09 49.59,71.82 46.42,71.82 45.15,73.09 45.15,101.03 46.42,102.3 DISP7.12
DIGC1  (via drill 0.35)
  Top 0.305: IC9.11 62.3,73.09 63.56,71.82 69.28,71.82 v75.63,78.17 | DISP7.9 62.93,103.57 v84.52,103.57
  Bottom 0.305: v84.52,103.57 84.52,78.17 v75.63,78.17
DIGC2  (via drill 0.35)
  Top 0.305: IC9.6 55.95,80.08 57.85,81.98 v65.47,81.98
  Bottom 0.305: DISP7.8 65.47,103.57 69.28,103.57 70.55,102.3 70.55,90.87 65.47,85.79 v65.47,81.98
DIGC3  (via drill 0.35)
  Top 0.305: IC9.7 57.22,79.44 58.48,80.71 66.1,80.71 v67.38,81.98
  Bottom 0.305: v67.38,81.98 68.01,81.98 71.82,85.79 71.82,99.76 74.36,99.76 74.36,92.14 75.63,90.87 79.44,90.87 81.98,93.41 81.98,104.84 83.25,106.11 88.33,106.11 DISP8.12
DIGC4  (via drill 0.35)
  Top 0.305: IC9.3 52.13,73.09 49.59,70.55 46.42,70.55 43.88,73.09 43.88,101.03 48.96,106.11 v99.76,106.11
  Bottom 0.305: DISP8.9 v99.76,106.11
DIGC5  (via drill 0.35)
  Top 0.305: IC9.10 v61.02,70.55 | v102.3,107.38 48.96,107.38 42.61,101.03 42.61,73.09 46.42,69.28 50.23,69.28 v51.5,70.55
  Bottom 0.305: DISP8.8 v102.3,107.38 | v51.5,70.55 v61.02,70.55
DIGC6  (via drill 0.35)
  Top 0.305: IC9.5 v54.67,73.09 | v73.09,98.49 LED77.K
  Bottom 0.305: v73.09,98.49 73.09,85.79 70.55,83.25 70.55,74.36 69.28,73.09 v54.67,73.09
DIGC7  (via drill 0.35)
  Top 0.305: IC9.8 v58.48,71.82
  Bottom 0.305: v58.48,71.82 74.36,71.82 79.44,76.9 87.06,76.9 102.3,92.14 111.19,92.14 113.73,94.68 LED78.K
DIN1_H  (via drill 0.35)
  Top 0.305: v47.69,141.67 48.96,141.67 IC6.1
  Bottom 0.305: LEVEL_SHIFTER.12 71.82,156.91 68.01,159.45 48.96,159.45 47.69,158.18 v47.69,141.67
DIN1_L  (via drill 0.35)
  Top 0.305: LEVEL_SHIFTER.1 74.36,151.83 v93.41,151.83 | v118.81,109.92 v128.97,109.92 | SV2.20 SV2.19
  Bottom 0.305: SV2.20 120.08,71.82 123.89,75.63 123.89,89.6 127.7,93.41 127.7,108.65 v128.97,109.92 | v93.41,151.83 93.41,145.48 83.25,135.32 83.25,115 88.33,109.92 v118.81,109.92
  Bottom 0.61: SV2.19 IC1.D27
DIN2
  Top 0.305: IC8.1 55.31,182.31 49.59,176.59 IC6.24
DIN3  (via drill 0.35)
  Top 0.305: IC8.24 179.77,182.31 187.39,174.69 v187.39,111.19 | IC9.1 49.59,78.81 46.42,81.98 46.42,97.22 50.23,101.03 v55.31,101.03 | v55.31,109.92 56.58,111.19 v184.85,111.19
  Bottom 0.305: v184.85,111.19 v187.39,111.19 | v55.31,101.03 v55.31,109.92
DIN4  (via drill 0.35)
  Top 0.305: IC9.24 v49.59,89.6 | v87.06,74.36 v127.7,74.36 | IC10.1 167.02,74.36 v159.45,74.36 | v149.29,74.36 v144.21,74.36
  Bottom 0.305: v49.59,89.6 42.61,89.6 41.34,88.33 41.34,69.28 43.88,66.74 79.44,66.74 v87.06,74.36 | v159.45,74.36 v149.29,74.36 | v144.21,74.36 v127.7,74.36
DIN5  (via drill 0.35)
  Top 0.305: v145.48,89.6 151.83,89.6 155.64,84.52 165.8,84.52 IC10.24
  Bottom 0.305: v145.48,89.6 145.48,26.1 151.83,19.75 151.83,5.78 148.02,1.97 92.14,1.97 89.6,4.51 89.6,21.02 87.06,23.56 83.25,23.56 80.71,21.02 80.71,4.51 78.17,1.97 29.91,1.97 4.51,27.37 4.51,66.74 8.32,70.55 24.83,70.55 27.37,73.09 27.37,75.63 24.83,78.17 4.51,78.17 1.97,80.71 1.97,146.12 9.59,153.74 26.1,153.74 27.37,155 27.37,160.72 24.83,163.26 1.97,163.26 1.97,198.82 2.61,199.45 IC7.1
GND  (via drill 0.35)
  Top 0.305: C6.2 151.83,186.12 C5.- | IC8.4 v151.83,178.5 | IC8.9 v151.83,172.15 v81.98,172.15 | 208.98,197.55 R10.1 208.98,200.09 201.36,207.71 198.82,207.71 IC2.GND 198.82,206.44 | C1.- 43.88,208.98 C2.2 43.88,212.79 40.07,216.6 23.56,216.6 17.21,210.25 v17.21,209.62 | C3.- 41.34,145.48 C4.2 44.52,146.12 52.13,146.12 | 52.13,146.12 53.41,144.84 IC6.4 | IC6.9 59.76,144.84 58.48,146.12 v57.85,146.12 52.13,146.12 | v17.21,203.26 v17.21,151.83 | IC4.GND 31.18,23.56 29.91,24.83 29.91,36.26 31.18,37.53 36.89,37.53 55.95,18.48 77.53,18.48 78.81,17.21 85.16,17.21 88.33,20.39 88.33,23.56 83.89,28 83.89,36.26 | IC5.10 83.89,36.89 | 83.89,36.89 83.89,36.26 | IC5.9 82.62,36.89 | 82.62,36.89 83.89,36.89 | IC5.8 81.34,36.89 | 81.34,36.89 82.62,36.89 | IC5.7 80.08,36.89 81.34,36.89 | C8.2 81.98,75 G1.- 79.44,69.28 78.17,68.01 59.76,68.01 | U$2.GND 149.29,56.58 v130.24,56.58 IC1.GND2 | v139.13,34.36 v130.24,34.36 IC1.GND v130.24,41.34 | IC5.11 83.89,50.23 82.62,50.23 | 82.62,50.23 81.34,50.23 | 81.34,50.23 80.08,50.23 | 80.08,50.23 78.81,50.23 IC5.15 78.81,46.42 73.72,46.42 | IC5.14 80.08,50.23 | IC5.13 81.34,50.23 | IC5.12 82.62,50.23 | 73.72,46.42 IC5.19 73.72,50.86 71.82,52.77 C9.2 | 73.72,46.42 70.55,46.42 69.28,47.69 69.28,48.96 68.65,49.59 58.48,49.59 55.95,52.13 55.95,67.38 | IC9.4 53.41,68.01 | 53.41,68.01 54.04,67.38 55.95,67.38 | 55.95,67.38 59.12,67.38 59.76,68.01 | C7.- 74.36,83.25 81.98,83.25 C8.2 | IC9.9 59.76,68.01 | IC5.1 IC5.2 73.72,44.52 | 73.72,44.52 73.72,46.42 | 73.72,44.52 v87.06,44.52 | v87.06,36.26 83.89,36.26 | IC3.1 110.56,86.42 | 110.56,86.42 104.84,80.71 C8.2 | 110.56,86.42 110.56,85.16 112.46,83.25 128.97,83.25 130.24,81.98 SV2.28 SV2.27
  Top 0.305: 53.41,68.01 43.88,68.01 40.07,71.82 40.07,109.92 41.34,111.19 v43.88,111.19 | SWITCH.4 186.12,18.37 186.12,14.67 | 186.12,14.67 216.6,14.67 VIN_5V.2 | 186.12,14.67 181.04,9.59 v139.13,9.59 | C10.- 152.47,78.81 153.1,78.17 C11.2 v158.18,69.28 170.88,69.28 | IC10.9 177.23,69.28 170.88,69.28 | 170.88,69.28 IC10.4 | SV1.28 SV1.27
  Bottom 0.305: C6.2 v151.83,178.5 v151.83,172.15 | IC7.4 v17.21,203.26 3.24,203.26 1.97,204.53 1.97,208.34 3.24,209.62 v17.21,209.62 IC7.9 | v81.98,172.15 LEVEL_SHIFTER.9 LEVEL_SHIFTER.4 81.98,142.94 68.01,142.94 68.01,150.56 66.74,151.83 66.74,153.1 59.12,153.1 57.85,151.83 v57.85,146.12 | R10.1 208.98,193.74 200.09,184.85 179.77,184.85 172.15,192.47 153.1,192.47 C5.- | v87.06,44.52 v87.06,36.26 | C4.2 v43.88,111.19 | v130.24,41.34 IC1.GND2 | U$2.GND 155.64,59.12 158.18,61.66 v158.18,69.28 | C3.- 34.99,151.83 v17.21,151.83 | v139.13,34.36 v139.13,9.59
  Bottom 0.61: SV2.27 IC1.GND2 | IC1.GND SV1.28
  pour Top (isolate 0.61): 0.7,229.3 229.3,229.3 229.3,222.95 229.3,0.7 226.76,0.7 1.97,0.7 0.7,0.7
  pour Bottom (isolate 1.016): 0.7,229.3 229.3,229.3 229.3,222.95 229.3,0.7 216.6,0.7 0.7,0.7 0.7,9.59
I2C_SCL  (via drill 0.35)  (1 unrouted)
  Top 0.305: IC5.18 75,50.86 | 75,50.86 84.52,60.39 v89.6,60.39 | IC5.20 72.45,50.86 58.48,50.86 57.22,52.13 57.22,53.41 58.48,54.67 71.19,54.67 75,50.86 | SV1.4 SV1.3 | v216.6,128.97 216.6,193.74 201.36,208.98 197.55,208.98 196.28,207.71 IC2.SCL
  Bottom 0.305: v216.6,128.97 204.53,128.97 203.26,127.7 203.26,114.36 202,113.09 127.06,113.09 123.89,109.92 123.89,93.41 121.98,91.5 116.91,91.5 116.27,90.87 IC3.3 116.27,80.71 115,79.44 90.87,79.44 89.6,78.17 v89.6,60.39 89.6,57.85 90.87,56.58 98.49,56.58 v99.76,55.31 IC1.D22
  Bottom 0.61: IC1.D22 SV1.4
I2C_SDA  (via drill 0.35)  (1 unrouted)
  Top 0.305: IC5.17 76.27,50.86 84.52,59.12 v90.81,59.12 90.87,59.12 | SV1.9 SV1.10 | v107.38,23.56 142.94,23.56 144.21,24.83 150.56,24.83 161.99,36.26 165.8,36.26 170.88,31.18 175.96,31.18 182.31,37.53 215.33,37.53 217.87,40.07 217.87,193.74 201.36,210.25 195.01,210.25 193.74,208.98 IC2.SDA
  Bottom 0.305: SV1.9 v107.38,23.56 | IC3.4 118.81,80.71 116.27,78.17 91.5,78.17 90.81,77.48 v90.81,59.12 90.81,58.54 91.5,57.85 98.49,57.85 v107.38,48.96 IC1.D21
  Bottom 0.61: IC1.D21 SV1.10
KEY  (via drill 0.35)
  Top 0.305: R5.1 R6.2 180.86,29.91 SWITCH.1 | SV2.8 SV2.7 | v134.05,38.8 148.02,38.8 149.29,37.53 v149.29,26.1
  Bottom 0.305: v149.29,26.1 153.1,26.1 158.18,31.18 169.63,31.18 SWITCH.1 | IC1.D34 104.84,54.04 120.08,38.8 v134.05,38.8
  Bottom 0.61: SV2.7 IC1.D34
LOAD_H  (via drill 0.35)
  Top 0.305: IC8.12 v158.18,168.34 v89.6,168.34 v76.9,168.34 LEVEL_SHIFTER.11 | IC10.12 181.04,71.82 182.31,70.55 187.39,70.55 188.66,71.82 v188.66,164.53 | IC6.12 v63.56,140.4 | IC9.12 v63.56,79.44
  Bottom 0.305: v188.66,164.53 159.45,164.53 158.18,165.8 v158.18,168.34 | IC7.12 19.75,213.43 19.75,221.68 21.02,222.95 48.96,222.95 50.23,221.68 50.23,215.33 52.13,213.43 55.95,213.43 56.58,212.79 56.58,201.36 52.77,197.55 52.77,195.01 57.85,189.93 74.36,189.93 76.9,187.39 v76.9,168.34 | v63.56,140.4 65.47,138.5 65.47,135.32 | 65.47,135.32 65.47,111.19 54.04,111.19 51.5,108.65 51.5,94.05 52.77,92.78 55.95,92.78 56.58,92.14 56.58,80.71 57.85,79.44 v63.56,79.44 | 65.47,135.32 70.55,135.32 70.55,139.13 71.82,140.4 84.52,140.4 89.6,145.48 v89.6,168.34
LOAD_L  (via drill 0.35)
  Top 0.305: LEVEL_SHIFTER.2 76.9,150.56 v92.14,150.56 | v116.27,108.65 v126.43,108.65 | SV2.18 SV2.17
  Bottom 0.305: SV2.18 117.54,70.55 117.54,71.82 122.62,76.9 122.62,89.6 126.43,93.41 v126.43,108.65 | v92.14,150.56 92.14,145.48 81.98,135.32 81.98,115 88.33,108.65 v116.27,108.65
  Bottom 0.61: SV2.17 IC1.D26
N$1  (via drill 0.35)
  Top 0.305: IC6.18 57.22,156.28 59.12,158.18 v59.12,161.99
  Bottom 0.305: v59.12,161.99 59.12,167.07 57.85,168.34 R2.2
N$2
  Bottom 0.305: IC7.18 40.07,207.07 41.97,208.98 41.97,214.06 43.25,215.33 R1.2
N$3  (via drill 0.35)
  Top 0.305: R3.2 v174.69,187.39 | v174.69,174.69 IC8.18
  Bottom 0.305: v174.69,187.39 v174.69,174.69
N$4
  Top 0.305: IC9.18 57.22,85.16 57.85,84.52 66.74,84.52 67.38,85.16 67.38,87.69 68.65,88.97 78.81,88.97 79.44,88.33 R4.2
N$5
  Top 0.305: IC5.16 77.53,50.86 81.34,54.67 G1.+
N$6  (via drill 0.35)
  Top 0.305: IC10.18 v174.69,87.06
  Bottom 0.305: v174.69,87.06 R13.2
N$7
  Top 0.305: SV1.21 SV1.22
  Bottom 0.61: IC1.D4 SV1.22
N$8
  Top 0.305: 201.36,27.97 R6.1 | 201.36,27.97 R7.2 | SWITCH.2 178.5,23.85 178.5,26.1 180.37,27.97 201.36,27.97
N$9
  Top 0.305: R8.2 R7.1 190.44,26.86 180.53,26.86 179.26,25.59 179.26,20.77 176.93,18.43 SWITCH.3
N$10
  Top 0.305: R8.1 R9.2 199.07,16.19 191.2,16.19 188.66,18.73 188.66,20 188.15,20.51 186.9,20.51 SWITCH.5
N$12
  Top 0.305: SWITCH.6 186.28,24.83 187.9,24.83 189.42,23.31 189.42,18.99 189.93,18.48 R9.1
N$27
  Top 0.305: SV1.26 SV1.25
  Bottom 0.61: IC1.D15 SV1.26
N$29
  Top 0.305: SV1.17 SV1.18
  Bottom 0.61: IC1.TX2 SV1.18
N$30
  Top 0.305: SV1.8 SV1.7
  Bottom 0.61: IC1.RX0 SV1.8
N$31
  Top 0.305: SV1.5 SV1.6
  Bottom 0.61: IC1.TX0 SV1.6
N$32
  Top 0.305: SV2.26 SV2.25
  Bottom 0.61: SV2.25 IC1.D13
N$33
  Top 0.305: SV2.24 SV2.23
  Bottom 0.61: SV2.23 IC1.D12
N$34
  Top 0.305: SV2.22 SV2.21
  Bottom 0.61: SV2.21 IC1.D14
N$35
  Top 0.305: SV2.12 SV2.11
  Bottom 0.61: SV2.11 IC1.D32
N$38
  Top 0.305: SV2.6 SV2.5
  Bottom 0.61: SV2.5 IC1.D39
N$39
  Top 0.305: SV2.4 SV2.3
  Bottom 0.61: SV2.3 IC1.D36
N$40
  Top 0.305: SV2.2 SV2.1
  Bottom 0.61: IC1.EN SV2.1
RX2
  Top 0.305: SV1.20 SV1.19
  Bottom 0.61: IC1.RX2 SV1.20
SEG0  (via drill 0.35)
  Top 0.305: v98.49,217.87 v41.34,217.87 | LED08.A LED07.A 179.1,189.31 LED06.A 168.34,200.07 168.34,200.09 164.53,200.09 163.73,200.89 LED05.A 161.43,203.9 156.85,203.9 LED04.A 148.39,206.35 LED03.A 137.22,210.11 LED02.A 134.5,212.79 123.89,212.79 | v98.49,212.79 123.89,212.79 | LED01.A 124.18,213.08 123.89,212.79
  Bottom 0.305: v98.49,212.79 v98.49,217.87 | v41.34,217.87 40.07,216.6 40.07,212.79 39.44,212.16 IC7.14
SEG1  (via drill 0.35)
  Top 0.305: LED16.A arc90 213.73,105.1 LED15.A 213.73,124.9 arc90 LED14.A 212.89,125.16 212.79,125.16 211.52,126.43 211.52,135.77 LED13.A 211.05,135.79 208.84,138 LED12.A 208.84,151.91 LED11.A | v40.07,208.98 43.25,205.81 48.96,205.81 53.41,210.25 75.63,210.25 87.06,198.82 165.8,198.82 172.15,192.47 174.69,192.47 193.38,173.78 LED09.A 200.33,168.08 LED10.A 205.17,160.16 205.17,155.76 LED11.A | LED11.A 205.17,155.58
  Bottom 0.305: IC7.16 39.44,209.62 v40.07,208.98
SEG2  (via drill 0.35)
  Top 0.305: 211.38,94.21 LED17.A 211.54,88.35 208.84,85.65 LED18.A | 208.84,84.52 LED18.A | v50.23,204.53 52.77,204.53 57.22,208.98 75.63,208.98 87.06,197.55 159.33,197.55 166.78,190.11 174.51,190.11 188.66,175.96 188.66,167.07 201.36,154.37 201.36,79.44 200.09,78.17 195.01,78.17 194.63,77.79 LED21.A | LED24.A 172.51,35.35 173.42,36.26 176.21,36.26 LED23.A LED22.A 194.63,54.68 LED21.A | LED21.A 194.63,57.47 200.33,63.17 LED20.A 200.33,66.34 205.08,71.09 LED19.A 205.17,74.42 205.17,75.63 208.84,79.3 LED18.A
  Bottom 0.305: IC7.20 v50.23,204.53
SEG3  (via drill 0.35)
  Top 0.305: 103.28,14.03 LED31.A | LED32.A 92.94,15.94 94.84,14.03 103.28,14.03 | v71.82,27.37 70.55,28.64 70.55,36.26 36.26,70.55 v36.26,85.79 | LED30.A 113.73,13.4 | 113.73,13.4 115,12.13 123.89,12.13 | 123.89,12.13 132.78,12.13 134.52,13.87 134.52,14.67 | 134.52,14.67 LED28.A | LED29.A 124.18,12.42 123.89,12.13 | 103.28,14.03 103.91,13.4 113.73,13.4 | 134.52,14.67 142.94,14.67 144.63,16.36 144.63,17.21 | 144.63,17.21 LED27.A | 144.63,17.21 153.1,17.21 154.4,18.51 154.4,21.02 | 154.4,21.02 LED26.A | 154.4,21.02 161.99,21.02 163.73,22.76 LED25.A
  Bottom 0.305: IC7.23 40.7,200.72 54.04,187.39 54.04,161.99 52.77,160.72 48.96,160.72 46.42,158.18 46.42,154.37 45.15,153.1 10.86,153.1 8.32,150.56 8.32,144.21 10.86,141.67 23.56,141.67 24.83,140.4 24.83,88.33 27.37,85.79 v36.26,85.79 | LED32.A 92.78,17.36 92.78,24.19 89.6,27.37 v71.82,27.37
SEG4  (via drill 0.35)
  Top 0.305: v27.37,92.14 27.37,65.24 arc-90 LED40.A 27.13,61.92 LED39.A 32.83,54.68 LED38.A LED37.A 53.41,34.1 LED36.A 60.65,28.4 LED35.A 68.48,23.65 LED34.A 76.82,19.89 LED33.A | v38.8,203.26 38.8,193.74 19.75,174.69 v19.75,150.56
  Bottom 0.305: v27.37,92.14 27.37,148.02 24.83,150.56 v19.75,150.56 | IC7.21 v38.8,203.26
SEG5  (via drill 0.35)
  Top 0.305: 18.46,145.9 LED48.A | LED41.A 21.16,74.33 18.62,76.87 LED42.A 18.46,84.1 15.92,86.64 LED43.A 14.28,95.85 LED44.A 13.73,105.1 LED45.A 13.73,124.9 LED46.A 14.28,134.15 LED47.A 15.92,143.2 LED48.A | LED48.A 18.48,146.04 18.48,203.9 29.91,215.33 37.53,215.33 38.8,214.06 v38.8,210.88
  Bottom 0.305: IC7.15 v38.8,210.88
SEG6  (via drill 0.35)
  Top 0.305: v36.26,208.34 48.7,195.9 LED54.A | LED56.A 68.48,206.35 LED55.A 60.65,201.6 LED54.A | LED54.A 53.41,195.9 LED53.A LED52.A 32.83,175.32 LED51.A 27.13,168.08 LED50.A 22.38,160.25 LED49.A
  Bottom 0.305: IC7.17 v36.26,208.34
SEG7  (via drill 0.35)
  Top 0.305: LED60.A 113.73,216.6 112.46,217.87 104.84,217.87 103.28,216.31 LED59.A 94.58,214.45 LED58.A 83.27,212.81 82.83,212.37 | 82.83,212.37 LED57.A | v55.31,212.16 55.8,212.65 82.55,212.65 arc-90 82.83,212.37 | LED61.A 167.3,191.2 174.69,191.2 189.93,175.96 189.93,168.34 195.77,162.5 LED62.A 196,162.27 202.63,155.64 202.63,115 | LED64.A 196,75.35 197.55,76.9 201.36,76.9 202.63,78.17 202.63,115 | LED63.A 202.63,115
  Bottom 0.305: v55.31,212.16 55.31,204.53 52.77,202 IC7.22 | LED61.A 131.46,197.27 LED60.A
SG0  (via drill 0.35)
  Top 0.305: IC6.14 v62.3,150.56
  Bottom 0.305: v62.3,150.56 66.74,150.56 DISP1.14
SG1
  Top 0.305: IC6.16 59.76,148.66 60.39,148.02 66.74,148.02 67.38,147.38 67.38,141.03 69.28,139.13 DISP1.13
SG2  (via drill 0.35)
  Top 0.305: DISP2.14 115,140.4 113.73,141.67 70.55,141.67 69.28,142.94 v69.28,151.83 | v54.67,155.64 IC6.20
  Bottom 0.305: v69.28,151.83 69.28,154.37 68.01,155.64 v54.67,155.64
SG3  (via drill 0.35)
  Top 0.305: DISP2.13 117.54,141.67 116.27,142.94 71.82,142.94 70.55,144.21 v70.55,150.56 | v50.86,156.91 IC6.23
  Bottom 0.305: v70.55,150.56 70.55,154.37 68.01,156.91 v50.86,156.91
SG4  (via drill 0.35)
  Top 0.305: DISP3.14 163.26,142.94 161.99,144.21 112.46,144.21 108.65,148.02 v108.65,160.72 | IC6.21 53.41,161.99 54.04,163.26 74.36,163.26 75.63,164.53 75.63,172.15 76.9,173.42 v108.65,173.42
  Bottom 0.305: v108.65,173.42 v108.65,160.72
SG5  (via drill 0.35)
  Top 0.305: DISP3.13 165.8,144.21 164.53,145.48 v112.46,145.48 | IC6.15 61.02,149.29 66.74,149.29 68.01,148.02 68.01,141.67 69.28,140.4 v112.46,140.4
  Bottom 0.305: v112.46,140.4 v112.46,145.48
SG6  (via drill 0.35)
  Top 0.305: IC6.17 58.48,148.66 59.76,147.38 66.1,147.38 66.74,146.75 66.74,140.4 65.47,139.13 65.47,135.32 v92.14,135.32
  Bottom 0.305: LED76.A 136.97,129.09 LED75.A 138.75,136.97 136.59,139.13 95.95,139.13 v92.14,135.32 90.5,133.68 LED73.A 90.5,123.52 88.7,121.72 LED74.A
SG7  (via drill 0.35)
  Top 0.305: LED66.A 113.73,19.75 115.64,17.84 132.15,17.84 134.69,20.39 142.31,20.39 145.48,23.56 150.56,23.56 155.64,28.64 157.14,28.64 LED65.A | IC6.22 v52.13,165.8 | LED71.A LED70.A 29.91,160.95 29.91,140.15 18.73,128.97 LED69.A 31.46,102.27 LED68.A LED67.A
  Bottom 0.305: LED67.A arc90 66.1,32.61 66.1,31.18 67.38,29.91 88.97,29.91 98.88,20 LED66.A | LED71.A 66.23,195.01 68.77,192.47 96.2,192.47 LED72.A | LED70.A 31.46,163.54 33.72,165.8 v52.13,165.8
SGA0  (via drill 0.35)
  Top 0.305: IC8.14 175.96,169.61 177.23,168.34 177.23,161.99 175.96,160.72 v165.8,160.72 v142.94,160.72 120.08,160.72 DISP4.11
  Bottom 0.305: DISP6.11 v165.8,160.72 | DISP5.11 v142.94,160.72
SGA1  (via drill 0.35)
  Top 0.305: DISP6.7 175.96,155.64 | 175.96,155.64 v153.1,155.64 v130.24,155.64 | IC8.16 178.5,172.15 179.77,170.88 179.77,156.91 178.5,155.64 175.96,155.64
  Bottom 0.305: v130.24,155.64 DISP4.7 | DISP5.7 v153.1,155.64
SGA2  (via drill 0.35)
  Top 0.305: v125.16,149.29 148.02,149.29 | 148.02,149.29 170.88,149.29 | DISP5.4 148.02,149.29 | IC8.20 179.77,177.23 182.31,174.69 v182.31,156.91 | DISP6.4 170.88,149.29 | 170.88,149.29 v182.31,149.29
  Bottom 0.305: DISP4.4 v125.16,149.29 | v182.31,149.29 v182.31,156.91
SGA3  (via drill 0.35)
  Top 0.305: v120.08,153.1 v142.94,153.1 v165.8,153.1 184.85,153.1 186.12,154.37 186.12,174.69 179.77,181.04 IC8.23
  Bottom 0.305: DISP4.2 v120.08,153.1 | v165.8,153.1 DISP6.2 | DISP5.2 v142.94,153.1
SGA4  (via drill 0.35)
  Top 0.305: v117.54,151.83 140.4,151.83 | 140.4,151.83 163.26,151.83 | DISP5.1 140.4,151.83 | 163.26,151.83 DISP6.1 | IC8.21 179.77,178.5 183.58,174.69 v183.58,156.91 | 163.26,151.83 v183.58,151.83
  Bottom 0.305: DISP4.1 v117.54,151.83 | v183.58,151.83 v183.58,156.91
SGA5
  Top 0.305: DISP6.10 168.34,159.45 | 145.48,159.45 122.62,159.45 DISP4.10 | 145.48,159.45 168.34,159.45 | DISP5.10 145.48,159.45 | IC8.15 177.23,170.88 178.5,169.61 178.5,160.72 177.23,159.45 168.34,159.45
SGA6  (via drill 0.35)
  Top 0.305: v127.7,148.02 v150.56,148.02 v173.42,148.02 | IC8.17 179.77,173.42 181.04,172.15 v181.04,156.91
  Bottom 0.305: DISP4.5 v127.7,148.02 | v150.56,148.02 DISP5.5 | v181.04,156.91 181.04,154.37 179.77,153.1 174.69,153.1 173.42,151.83 DISP6.5 v173.42,148.02
SGA7  (via drill 0.35)
  Top 0.305: v122.62,154.37 v145.48,154.37 v168.34,154.37 183.58,154.37 184.85,155.64 184.85,174.69 179.77,179.77 IC8.22
  Bottom 0.305: DISP4.3 v122.62,154.37 | v168.34,154.37 DISP6.3 | DISP5.3 v145.48,154.37
SGB0  (via drill 0.35)
  Top 0.305: IC10.14 179.77,88.33 177.23,90.87 LED79.A 177.23,106.11 v155.64,106.11 132.78,106.11 DISP9.11
  Bottom 0.305: v155.64,106.11 DISP10.11
SGB1  (via drill 0.35)
  Top 0.305: IC10.16 177.23,88.33 172.15,93.41 172.15,102.3 DISP10.7 165.8,104.84 v142.94,104.84
  Bottom 0.305: DISP9.7 v142.94,104.84
SGB2  (via drill 0.35)
  Top 0.305: v137.86,99.76 151.83,99.76 152.47,100.39 154.37,100.39 155,99.76 v160.72,99.76 168.34,99.76 170.88,97.22 170.88,92.14 172.15,90.87 IC10.20
  Bottom 0.305: DISP9.4 v137.86,99.76 | v160.72,99.76 DISP10.4
SGB3  (via drill 0.35)
  Top 0.305: v132.78,97.22 v155.64,97.22 167.07,97.22 168.34,95.95 IC10.23
  Bottom 0.305: DISP9.2 v132.78,97.22 | v155.64,97.22 DISP10.2
SGB4  (via drill 0.35)
  Top 0.305: DISP9.1 130.24,95.95 153.1,95.95 DISP10.1 | IC10.21 170.88,90.87 170.25,91.5 170.25,96.59 167.7,99.12 161.05,99.12 161,99.08 158.56,99.08 158.46,99.17 157.9,99.17 157.85,99.12 v153.1,99.12
  Bottom 0.305: v153.1,99.12 DISP10.1
SGB5  (via drill 0.35)
  Top 0.305: v135.32,108.65 v158.18,108.65 v173.42,108.65 | IC10.15 178.5,88.33 173.42,93.41 v173.42,104.84
  Bottom 0.305: DISP10.10 v158.18,108.65 | v135.32,108.65 DISP9.10 | v173.42,104.84 v173.42,108.65
SGB6  (via drill 0.35)
  Top 0.305: v139.13,101.03 v161.99,101.03 | IC10.17 v175.96,88.33
  Bottom 0.305: v175.96,88.33 168.34,88.33 163.26,93.41 DISP10.5 163.02,94.92 163.02,99.03 161.99,100.05 v161.99,101.03 | v139.13,101.03 139.13,100.05 140.4,98.78 DISP9.5
SGB7  (via drill 0.35)
  Top 0.305: v135.32,98.49 151.83,98.49 152.47,97.86 155,97.86 155.64,98.49 v158.18,98.49 167.07,98.49 169.61,95.95 IC10.22
  Bottom 0.305: DISP9.3 v135.32,98.49 | v158.18,98.49 DISP10.3
SGC0  (via drill 0.35)
  Top 0.305: IC9.14 62.3,92.14 | 62.3,92.14 61.66,92.78 v57.85,92.78 | 62.3,92.14 62.93,92.78 v78.17,92.78
  Bottom 0.305: v57.85,92.78 57.85,101.03 DISP7.11 | v78.17,92.78 LED77.A 78.17,103.57 81.98,107.38 89.6,107.38 DISP8.11 94.68,101.03 95.95,99.76 111.19,99.76 112.46,101.03 115,101.03 116.27,99.76 LED78.A
SGC1  (via drill 0.35)
  Top 0.305: IC9.16 v59.76,90.23 | DISP7.7 85.79,102.3 88.33,99.76 103.57,99.76 104.84,101.03 DISP8.7
  Bottom 0.305: DISP7.7 68.01,101.03 68.01,90.87 67.38,90.23 v59.76,90.23
SGC2  (via drill 0.35)
  Top 0.305: IC9.20 54.67,84.52 54.04,83.89 48.33,83.89 47.69,84.52 47.69,97.22 50.23,99.76 v61.66,99.76 83.89,99.76 85.79,97.86 99.76,97.86 DISP8.4
  Bottom 0.305: DISP7.4 v61.66,99.76
SGC3  (via drill 0.35)
  Top 0.305: DISP8.2 94.68,96.59 71.19,96.59 70.55,97.22 v56.58,97.22 50.86,97.22 IC9.23
  Bottom 0.305: DISP7.2 v56.58,97.22
SGC4
  Top 0.305: DISP8.1 92.14,95.95 54.04,95.95 DISP7.1 53.41,94.05 IC9.21
SGC5  (via drill 0.35)
  Top 0.305: IC9.15 v61.02,91.5 | v59.12,104.84 v97.22,104.84
  Bottom 0.305: v61.02,91.5 60.39,92.14 60.39,101.03 DISP7.10 v59.12,104.84 | DISP8.10 v97.22,104.84
SGC6  (via drill 0.35)
  Top 0.305: v64.2,101.03 v69.28,101.03 84.52,101.03 87.06,98.49 101.03,98.49 102.3,97.22 DISP8.5 | v58.48,88.97 IC9.17
  Bottom 0.305: DISP7.5 v64.2,101.03 | v69.28,101.03 69.28,90.87 67.38,88.97 v58.48,88.97
SGC7  (via drill 0.35)
  Top 0.305: DISP8.3 97.22,97.22 71.82,97.22 70.55,98.49 v59.12,98.49 50.23,98.49 48.33,96.59 48.33,85.16 48.96,84.52 52.13,84.52 IC9.22
  Bottom 0.305: DISP7.3 v59.12,98.49
SPI_CLK  (via drill 0.35)
  Top 0.305: IC4.CLK 36.89,28.64 52.13,13.4 86.42,13.4 90.87,17.84 90.87,19.11 94.05,22.29 v112.46,22.29 | SV1.14 SV1.13
  Bottom 0.305: SV1.13 v112.46,22.29
  Bottom 0.61: IC1.D18 SV1.14
SPI_CS
  Top 0.305: IC4.CS 36.26,33.72 54.04,15.94 86.42,15.94 89.6,19.11 89.6,20.39 94.05,24.83 115,24.83 SV1.15 SV1.16
  Bottom 0.61: IC1.D5 SV1.16
SPI_MISO  (via drill 0.35)
  Top 0.305: IC4.MISO 37.53,26.1 51.5,12.13 86.42,12.13 91.5,17.21 91.5,18.48 94.05,21.02 v109.92,21.02 | SV1.11 SV1.12
  Bottom 0.305: SV1.11 v109.92,21.02
  Bottom 0.61: IC1.D19 SV1.12
SPI_MOSI  (via drill 0.35)
  Top 0.305: IC4.MOSI 36.26,31.18 52.77,14.67 86.42,14.67 90.23,18.48 90.23,19.75 94.05,23.56 v97.22,23.56 | SV1.1 SV1.2
  Bottom 0.305: SV1.1 v97.22,23.56
  Bottom 0.61: IC1.D23 SV1.2
XX
  Top 0.305: SV1.24 SV1.23
  Bottom 0.61: IC1.D2 SV1.24

## Text on the board
tNames: HODINY v4 / Peter Vitaz / 2019